# EAGLE design FSI6CAN (EAGLE 9.5.0)
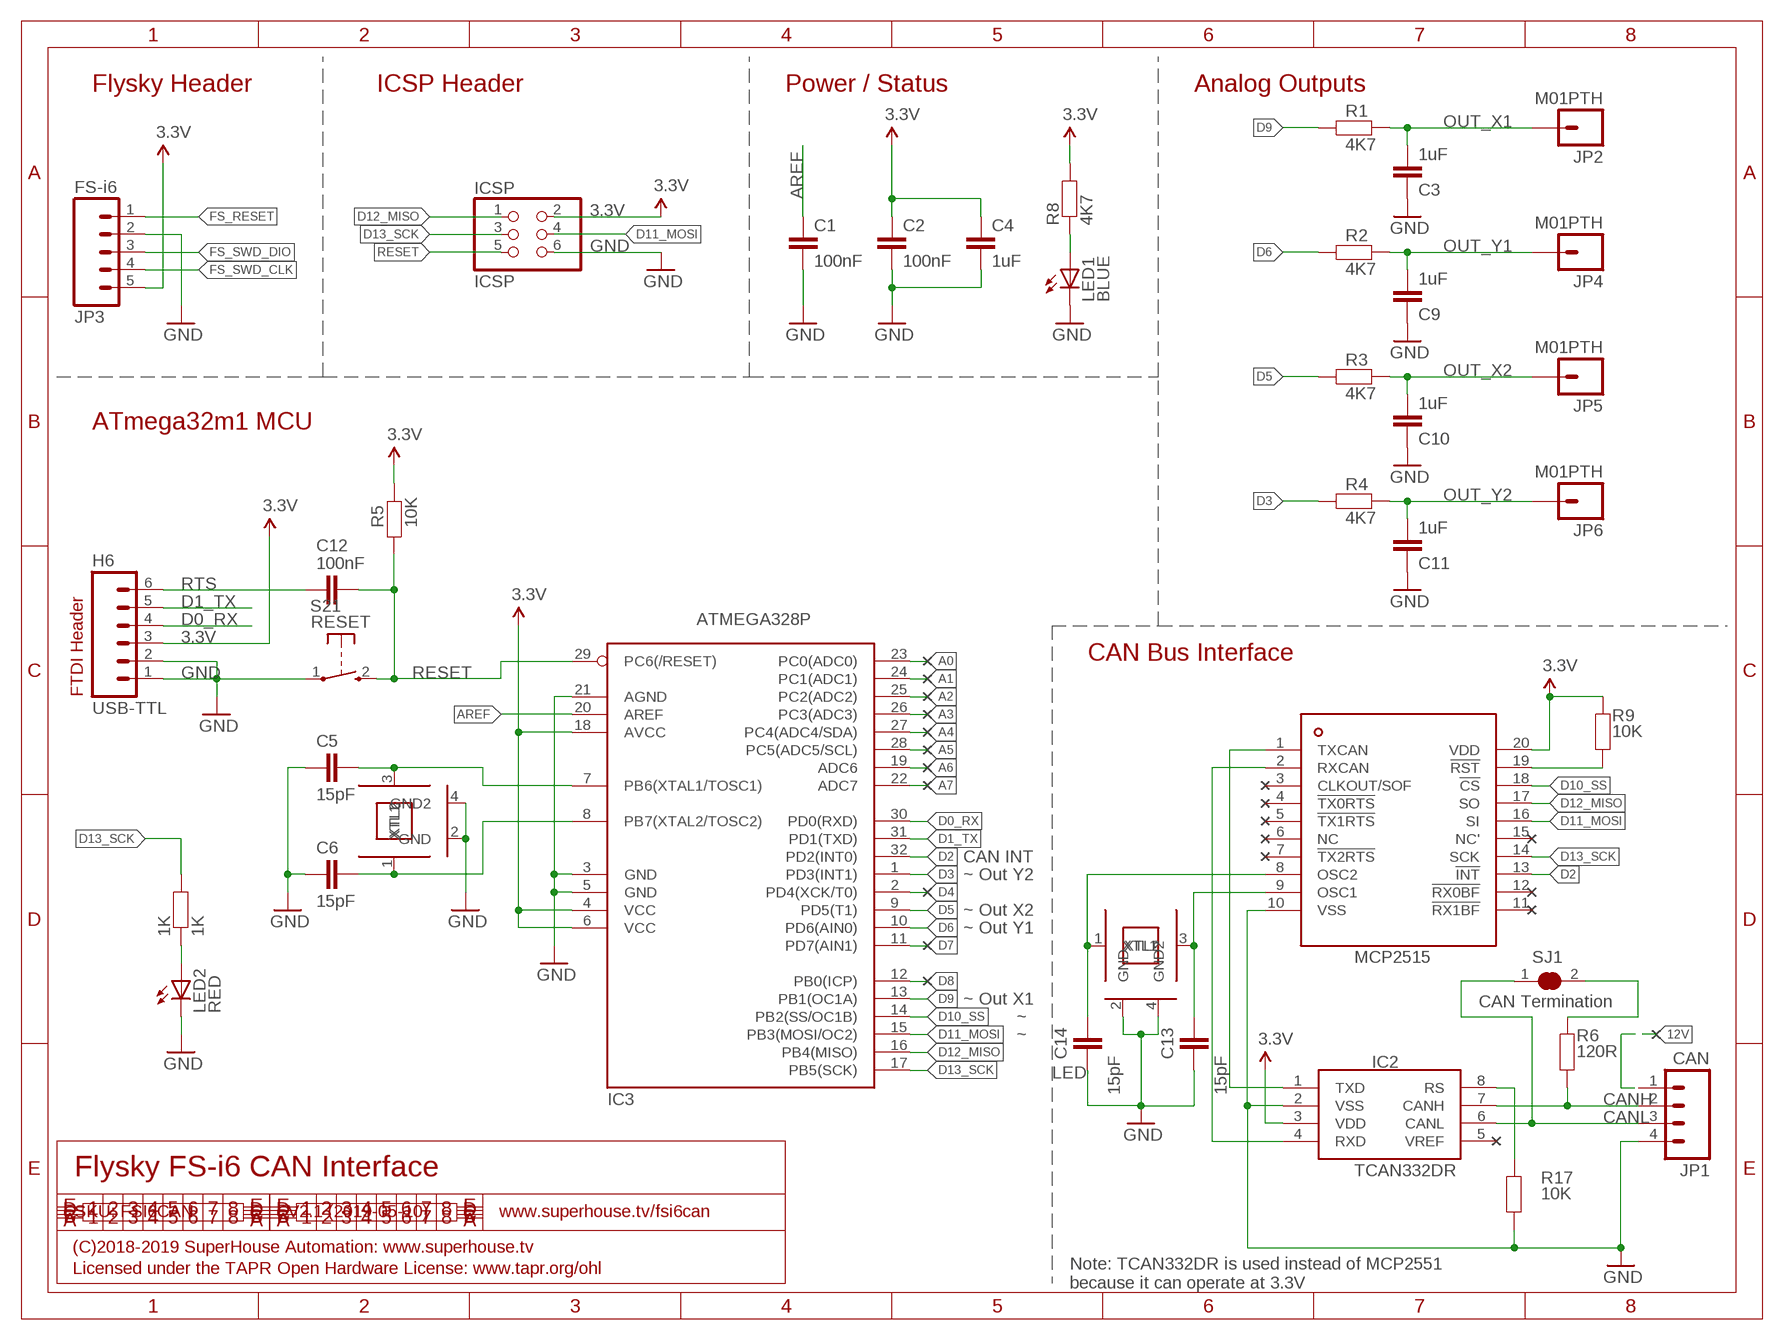
[diagram p0: schematic, sheet 1]

## Parts
1K  1K  RESISTOR0603  [R0603]
C1  100nF  CAP0603  [C0603]
C2  100nF  CAP0603  [0603]
C3  1uF  CAP0603  [C0603]
C4  1uF  CAP0603  [0603]
C5  15pF  CAP0603  [C0603]
C6  15pF  CAP0603  [C0603]
C9  1uF  CAP0603  [C0603]
C10  1uF  CAP0603  [C0603]
C11  1uF  CAP0603  [C0603]
C12  100nF  CAP0603  [0603]
C13  15pF  CAP0603  [C0603]
C14  15pF  CAP0603  [C0603]
H6  USB-TTL  M06SIP  [1X06]
IC2  TCAN332DR  MCP2551  [SO08]
IC3  ATMEGA328P  AVR-MEGA8-AI  [TQFP32-08]
IC4  MCP2515  [TSSOP20]
ICSP  ICSP  PINHD-2X3  [2X03]
JP1  CAN  M04PTH  [1X04]
JP2  M01PTH  [1X01]
JP3  FS-i6  M05PTH  [1X05]
JP4  M01PTH  [1X01]
JP5  M01PTH  [1X01]
JP6  M01PTH  [1X01]
LED1  BLUE  LED0603  [LED-0603]
LED2  RED  LED0603  [LED-0603]
R1  4K7  RESISTOR0603  [R0603]
R2  4K7  RESISTOR0603  [R0603]
R3  4K7  RESISTOR0603  [R0603]
R4  4K7  RESISTOR0603  [R0603]
R5  10K  RESISTOR0603  [0603]
R6  120R  RESISTOR0603  [0603]
R8  4K7  RESISTOR0603  [0603]
R9  10K  RESISTOR0603  [R0603]
R17  10K  RESISTOR0603  [R0603]
S21  RESET  TAC_SWITCH_2PINSMT  [TACTILE_SMT_3X4X2]
SJ1  CAN Termination  SJCN  [SJC]
XTL1  8MHz  CRYSTAL-GND3X2  [CRYSTAL-SMD-3X2]
XTL3  16MHz  CRYSTAL-GND3X2  [CRYSTAL-SMD-3X2]

## Nets
3.3V: C2.1 C4.1 H6.3 IC2.3(VDD) IC3.4(VCC) IC3.6(VCC) IC3.18(AVCC) IC4.20(VDD) ICSP.2 JP3.5 R5.1 R8.2 R9.2
12V: JP1.1
A0: IC3.23(PC0(ADC0))
A1: IC3.24(PC1(ADC1))
A2: IC3.25(PC2(ADC2))
A3: IC3.26(PC3(ADC3))
A4: IC3.27(PC4(ADC4/SDA))
A5: IC3.28(PC5(ADC5/SCL))
A6: IC3.19(ADC6)
A7: IC3.22(ADC7)
AREF: C1.1 IC3.20(AREF)
CANH: IC2.7(CANH) JP1.2 R6.1
CANL: IC2.6(CANL) JP1.3 SJ1.1
D0_RX: H6.4 IC3.30(PD0(RXD))
D1_TX: H6.5 IC3.31(PD1(TXD))
D2: IC3.32(PD2(INT0)) IC4.13(!INT)
D3: IC3.1(PD3(INT1)) R4.1
D4: IC3.2(PD4(XCK/T0))
D5: IC3.9(PD5(T1)) R3.1
D6: IC3.10(PD6(AIN0)) R2.1
D7: IC3.11(PD7(AIN1))
D8: IC3.12(PB0(ICP))
D9: IC3.13(PB1(OC1A)) R1.1
D10_SS: IC3.14(PB2(SS/OC1B)) IC4.18(!CS)
D11_MOSI: IC3.15(PB3(MOSI/OC2)) IC4.16(SI) ICSP.4
D12_MISO: IC3.16(PB4(MISO)) IC4.17(SO) ICSP.1
D13_SCK: 1K.2 IC3.17(PB5(SCK)) IC4.14(SCK) ICSP.3
FS_RESET: JP3.1
FS_SWD_CLK: JP3.4
FS_SWD_DIO: JP3.3
GND: C1.2 C2.2 C3.2 C4.2 C5.1 C6.1 C9.2 C10.2 C11.2 C13.1 C14.1 H6.1 H6.2 IC2.2(VSS) IC3.3(GND) IC3.5(GND) IC3.21(AGND) IC4.10(VSS) ICSP.6 JP1.4 JP3.2 LED1.C LED2.C R17.1 S21.1(P) XTL1.2(GND) XTL1.4(GND2) XTL3.2(GND) XTL3.4(GND2)
N$1: 1K.1 LED2.A
N$2: R6.2 SJ1.2
N$4: IC2.1(TXD) IC4.1(TXCAN)
N$5: LED1.A R8.1
N$6: IC2.4(RXD) IC4.2(RXCAN)
N$7: C13.2 IC4.9(OSC1) XTL3.3(XTL2)
N$8: C14.2 IC4.8(OSC2) XTL3.1(XTL1)
N$11: C5.2 IC3.7(PB6(XTAL1/TOSC1)) XTL1.3(XTL2)
N$12: C6.2 IC3.8(PB7(XTAL2/TOSC2)) XTL1.1(XTL1)
N$16: IC2.8(RS) R17.2
N$17: IC4.19(!RST) R9.1
OUT_X1: C3.1 JP2.1 R1.2
OUT_X2: C10.1 JP5.1 R3.2
OUT_Y1: C9.1 JP4.1 R2.2
OUT_Y2: C11.1 JP6.1 R4.2
RESET: C12.2 IC3.29(PC6(/RESET)) ICSP.5 R5.2 S21.2(S)
RTS: C12.1 H6.6
Unconnected: IC2.5(VREF) IC4.3(CLKOUT/SOF) IC4.4(!TX0RTS) IC4.5(!TX1RTS) IC4.6(NC) IC4.7(!TX2RTS) IC4.11(!RX1BF) IC4.12(!RX0BF) IC4.15(NC')

## Notes on the sheet
- Flysky Header | ICSP Header | Power / Status | Analog Outputs
- ATmega32m1 MCU
- CAN Bus Interface
- FTDI Header
- CAN INT
- ~ Out Y2
- ~ Out X2
- ~ Out Y1
- ~ Out X1
- ~
- ~
- LED
- Flysky FS-i6 CAN Interface
- SKU: FSI6CAN | V2.1 (2019-05-10) | www.superhouse.tv/fsi6can
- (C)2018-2019 SuperHouse Automation: www.superhouse.tv
- Licensed under the TAPR Open Hardware License: www.tapr.org/ohl
- Note: TCAN332DR is used instead of MCP2551
  because it can operate at 3.3V

## Library data of the parts
1K R1-R4 R9 R17 = SuperHouse-DiscreteSemi:RESISTOR: Resistor
C1 C3 C5 C6 C9-C11 C13 C14 = SuperHouse-DiscreteSemi:CAP: Capacitor
C2 C4 C12 = freetronics-master-v1.1:CAP: Capacitor
H6 = freetronics:M06: Header 6 Standard 6-pin 0.1" header. Use with straight break away headers (SKU : PRT-00116), right angle break away headers (PRT-00553), swiss pins (PRT-00743), machine pins (PRT-00117), and female headers (PRT-00115). Molex polarized connector foot print use with SKU : PRT-08094 with associated crimp pins and housings. NOTES ON THE VARIANTS LOCK and LOCK_LONGPADS... This footprint was designed to help hold the alignment of a through-hole component (i.e. 6-pin header) while soldering it into place. You may notice that each hole has been shifted either up or down by 0.005 of an inch from it's more standard position (which is a perfectly straight line). This slight alteration caused the pins (the squares in the middle) to touch the edges of the holes. Because they are alternating, it causes a "brace" to hold the component in place. 0.005 has proven to be the perfect amount of "off-center" position when using our standard breakaway headers. Although looks a little odd when you look at the bare footprint, once you have a header in there, the alteration is very hard to notice. Also, if you push a header all the way into place, it is covered up entirely on the bottom side. This idea of altering the position of holes to aid alignment will be further integrated into the Sparkfun Library for other footprints. It can help hold any component with 3 or more connection pins.
IC2 = freetronics-original:MCP2551
IC3 = freetronics-master-v1.1:AVR-MEGA8: MICROCONTROLLER 8 Kbytes FLASH 1 kbytes SRAM 512 bytes EEPROM USART 6-channel 10 bit ADC 2-channel 8 bit ADC
IC4 = MCP2515:MCP2515: Microchip Technology’s MCP2515 is a stand-alone Controller Area Network (CAN) controller that implements the CAN specification, version 2.0B. It is capable of transmitting and receiving both standard and extended data and remote frames. The MCP2515 has two acceptance masks and six acceptance filters that are used to filter out unwanted messages, thereby reducing the host MCUs overhead. The MCP2515 interfaces with microcontrollers (MCUs) via an industry standard Serial Peripheral Interface (SPI).
ICSP = pinhead:PINHD-2X3: PIN HEADER
JP1 = freetronics-jon:M04: Header 4 Standard 4-pin 0.1" header. Use with straight break away headers (SKU : PRT-00116), right angle break away headers (PRT-00553), swiss pins (PRT-00743), machine pins (PRT-00117), and female headers (PRT-00115). Molex polarized connector foot print use with SKU : PRT-08231 with associated crimp pins and housings. 1MM SMD Version SKU: PRT-10208
JP2 JP4-JP6 = freetronics-jon:M01: Header 1 Standard 1-pin 0.1" header. Use with straight break away headers (SKU : PRT-00116), right angle break away headers (PRT-00553), swiss pins (PRT-00743), machine pins (PRT-00117), and female headers (PRT-00115).
JP3 = freetronics-jon:M05: Header 5 Standard 5-pin 0.1" header. Use with straight break away headers (SKU : PRT-00116), right angle break away headers (PRT-00553), swiss pins (PRT-00743), machine pins (PRT-00117), and female headers (PRT-00115). Molex polarized connector foot print use with SKU : PRT-08230 with associated crimp pins and housings.
LED1 LED2 = freetronics-jon:LED: LEDs Standard schematic elements and footprints for 5mm, 3mm, 1206, and 0603 sized LEDs. 5mm - Spark Fun Electronics SKU : COM-00529 (and others)
R5 R6 = freetronics-master-v1.1:RESISTOR: Resistor
R8 = freetronics-jon:RESISTOR: Resistor
S21 = SuperHouse-Switches:TAC_SWITCH_2PIN: Momentary Tactile Switch - 2 pin Uxcell 3x4x2mm switch with 2 SMT pads
SJ1 = freetronics-jon:SJC
XTL1 XTL3 = freetronics-jon:CRYSTAL-GND

## Board
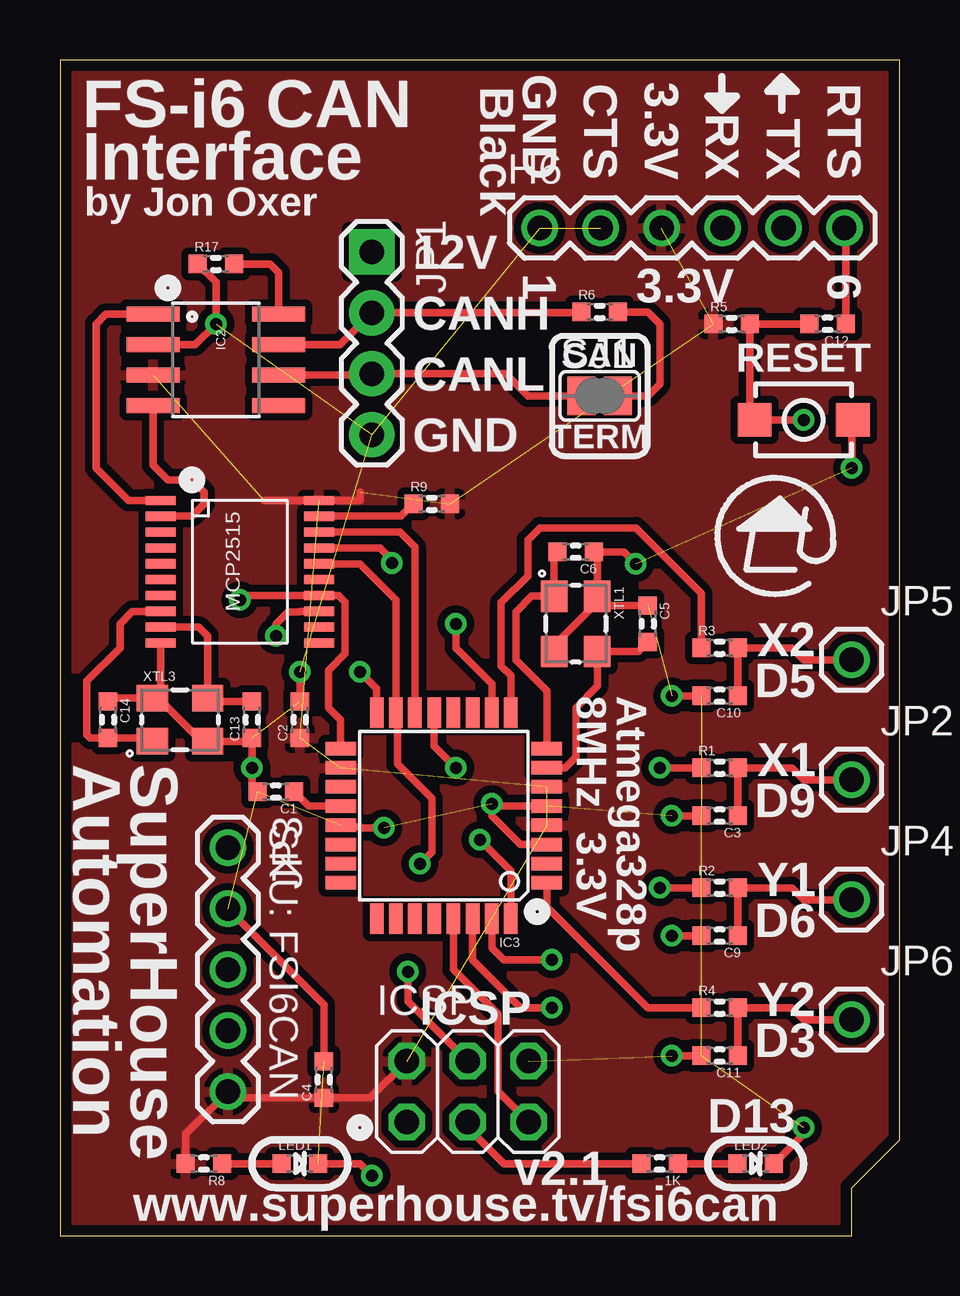
[diagram p1: board, top side]
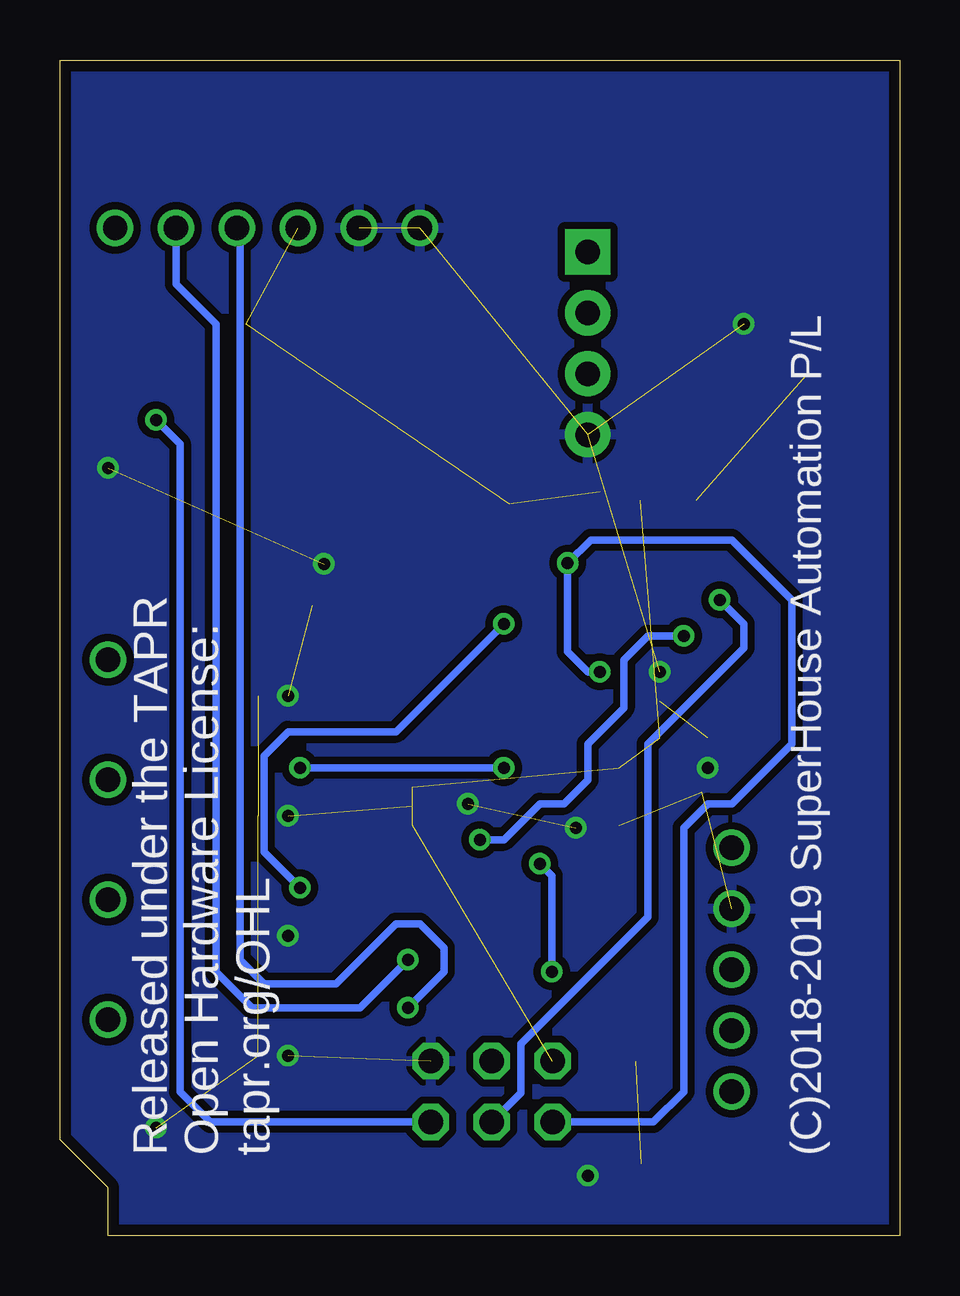
[diagram p2: board, bottom side, seen from below]

Size 35 x 49 mm. Coordinates in mm from the lower left corner, seen from the top.
Outline: 35,4 35,49 0,49 0,0 33,0 33,2 35,4
Copper layers (1*16): Top 0.035mm / dielectric 1.5mm / Bottom 0.035mm
Design rules "default *": minimum track width 10mil, minimum drill 0.5mm, track to track 12mil, track to pad 12mil, pad to pad 12mil, via to via 12mil, smd to smd 8mil, copper to edge 18mil, drill to drill 8mil, minimum pad ring 10mil, minimum via ring 8mil, stop-mask expansion 0.4mm, vias tented up to drill 0.7mm, thermal gap 10mil

### Footprints (pad centres in the part's own frame; a part is rotated, then mirrored left to right if it is on the bottom)
R0603 = smd 0.762 x 0.762: 1 -0.762,0; 2 0.762,0
C0603 = smd 0.762 x 0.762: 1 -0.762,0; 2 0.762,0
0603 = smd 0.762 x 0.762: 1 -0.762,0; 2 0.762,0
1X06 = drill 1.016: 1 0,0; 2 2.54,0; 3 5.08,0; 4 7.62,0; 5 10.16,0; 6 12.7,0
SO08 = smd 0.61 x 2.21: 1 -1.905,-2.616; 2 -0.635,-2.616; 3 0.635,-2.616; 4 1.905,-2.616; 5 1.905,2.616; 6 0.635,2.616; 7 -0.635,2.616; 8 -1.905,2.616
TQFP32-08 = smd 1.27 x 0.559: 1 -4.293,2.8; 2 -4.293,2; 3 -4.293,1.2; 4 -4.293,0.4; 5 -4.293,-0.4; 6 -4.293,-1.2; 7 -4.293,-2; 8 -4.293,-2.8; 17 4.293,-2.8; 18 4.293,-2; 19 4.293,-1.2; 20 4.293,-0.4; 21 4.293,0.4; 22 4.293,1.2; 23 4.293,2; 24 4.293,2.8 | smd 0.559 x 1.27: 9 -2.8,-4.293; 10 -2,-4.293; 11 -1.2,-4.293; 12 -0.4,-4.293; 13 0.4,-4.293; 14 1.2,-4.293; 15 2,-4.293; 16 2.8,-4.293; 25 2.8,4.293; 26 2,4.293; 27 1.2,4.293; 28 0.4,4.293; 29 -0.4,4.293; 30 -1.2,4.293; 31 -2,4.293; 32 -2.8,4.293
TSSOP20 = smd 1.27 x 0.381: 1 -3.302,2.642; 2 -3.302,1.981; 3 -3.302,1.321; 4 -3.302,0.66; 5 -3.302,0; 6 -3.302,-0.66; 7 -3.302,-1.321; 8 -3.302,-1.981; 9 -3.302,-2.642; 10 -3.302,-3.302; 11 3.302,-3.302; 12 3.302,-2.642; 13 3.302,-1.981; 14 3.302,-1.321; 15 3.302,-0.66; 16 3.302,0; 17 3.302,0.66; 18 3.302,1.321; 19 3.302,1.981; 20 3.302,2.642
2X03 = drill 1.016 octagon: 1 -2.54,-1.27; 2 -2.54,1.27; 3 0,-1.27; 4 0,1.27; 5 2.54,-1.27; 6 2.54,1.27
1X04 = drill 1.016 pad 1.88 square: 1 0,0 | drill 1.016 pad 1.88: 2 2.54,0; 3 5.08,0; 4 7.62,0
1X01 = drill 1.016: 1 0,0
1X05 = drill 1.016: 1 0,0; 2 2.54,0; 3 5.08,0; 4 7.62,0; 5 10.16,0
LED-0603 = smd 0.762 x 0.762: A -0.762,0; C 0.762,0
TACTILE_SMT_3X4X2 = smd 1.4 x 1.4: 1 -2.05,0; 2 2.05,0
SJC = smd 1.168 x 1.6: 1 -0.762,0; 2 0.762,0
CRYSTAL-SMD-3X2 = smd 1.3 x 1.1: 1 -1.15,-0.9; 2 1.15,-0.9; 3 1.15,0.9; 4 -1.15,0.9

### Placement (x,y rotation side)
1K  25,3 180 top
C1  9,18.5 180 top
C2  10,21.5 90 top
C3  27.5,17.5 180 top
C4  11,6.5 90 top
C5  24.5,25.5 270 top
C6  21.5,28.5 180 top
C9  27.5,12.5 180 top
C10  27.5,22.5 180 top
C11  27.5,7.5 180 top
C12  32,38 180 top
C13  8,21.5 90 top
C14  2,21.5 270 top
H6  20,42 0 top
IC2  6.5,36.5 270 top
IC3  16,17.5 180 top
IC4  7.5,28 0 top
ICSP  17,6 0 top
JP1  13,41 270 top
JP2  33,19 0 top
JP3  7,16.16 270 top
JP4  33,14 0 top
JP5  33,24 0 top
JP6  33,9 0 top
LED1  10,3 0 top
LED2  29,3 0 top
R1  27.5,19.5 0 top
R2  27.5,14.5 0 top
R3  27.5,24.5 0 top
R4  27.5,9.5 0 top
R5  28,38 0 top
R6  22.5,38.5 0 top
R8  6,3 180 top
R9  15.5,30.5 0 top
R17  6.5,40.5 0 top
S21  31,34 180 top
SJ1  22.5,35 0 top
XTL1  21.5,25.5 270 top
XTL3  5,21.5 0 top

### Tracks (layer width: path | path; a pad name or v marks a point on that pad's centre or on a via)
3.3V  (9 unrouted)
  Top 0.305: R8.2 5.24,4.24 JP3.5 7.26,5.74 C4.1 12.93,5.74 ICSP.2 | 12.5,31 12.5,30.64 IC4.20 8.5,30.64
  pour Top: 35,4 33,2 33,0 0,0 0,49 35,49
AREF
  Top 0.305: C1.1 10.36,17.9 IC3.20
CANH
  Top 0.305: IC2.7 11.68,37.13 JP1.2 21.7,38.46 R6.1
CANL
  Top 0.305: IC2.6 12.95,35.87 JP1.3 18.58,35.92 19.5,35 SJ1.1
D0_RX  (via drill 0.5)
  Top 0.305: IC3.30 17.2,11.5 19.2,9.5 v20.5,9.5
  Bottom 0.305: v20.5,9.5 19,11 19,12 20,13 21,13 23.5,10.5 26.5,10.5 27.5,11.5 27.5,41.88 H6.4
D1_TX  (via drill 0.5)
  Top 0.305: IC3.31 18,12 18.5,11.5 v20.5,11.5
  Bottom 0.305: v20.5,11.5 22.5,9.5 27,9.5 28.5,11 28.5,38 30.16,39.66 H6.5
D2  (via drill 0.5)
  Top 0.305: IC4.13 10.79,26.01 9.98,26.01 9.97,26 9.5,26 9,25.5 v9,25 | v17.5,16.5 18.8,15.2 IC3.32
  Bottom 0.305: v9,25 10.5,25 11.5,24 11.5,22 13,20.5 13,19 14,18 15,18 16.5,16.5 v17.5,16.5
D3
  Top 0.305: R4.1 24.5,9.5 20.29,13.71 IC3.1
D5
  Top 0.305: IC3.9 18.8,23.34 18.39,23.75 18.39,26.39 19.5,27.5 19.5,29 20,29.5 24,29.5 26.74,26.76 R3.1
D6  (via drill 0.5)
  Top 0.305: R2.1 v25,14.5 | v16.5,25.5 16.5,24.5 18,23 IC3.10
  Bottom 0.305: v25,14.5 26.5,16 26.5,20 25.5,21 21,21 v16.5,25.5
D9  (via drill 0.5)
  Top 0.305: R1.1 v25,19.5 | IC3.13 15.6,20.4 v16.5,19.5
  Bottom 0.305: v16.5,19.5 v25,19.5
D10_SS
  Top 0.305: IC4.18 14.18,29.32 14.8,28.7 IC3.14
D11_MOSI  (via drill 0.5)
  Top 0.305: IC4.16 12.5,28 14,26.5 IC3.15 14.06,21.73 14.06,19.65 15.5,18.21 15.5,16 v15,15.5 | ICSP.4 14.5,9.77 v14.5,11
  Bottom 0.305: v14.5,11 14.5,15 v15,15.5
D12_MISO  (via drill 0.5)
  Top 0.305: IC4.17 13.34,28.66 14,28 13.87,28 v13.84,28.03 | v12.5,23.5 13.2,22.8 IC3.16
  Bottom 0.305: v12.5,23.5 13,23.5 13.84,24.34 v13.84,28.03 12.87,29 7,29 4.5,26.5 4.5,20.5 7,18 8,18 9,17 9,6 10.27,4.73 ICSP.1
D13_SCK  (via drill 0.5)
  Top 0.305: ICSP.3 17,4.5 18.5,3 1K.2 | IC3.17 11.71,21.5 11.21,22 11.19,22 11.19,23.56 11.89,24.26 11.89,26.4 11.61,26.68 IC4.14 7.68,26.68 v7.5,26.5
  Bottom 0.305: ICSP.3 15.78,5.95 15.78,8 10.5,13.28 10.5,20.5 6.5,24.5 6.5,25.5 v7.5,26.5
GND  (via drill 0.5)  (17 unrouted)
  Top 0.305: v31,4.5 31,4.24 LED2.C | C10.2 v25.5,22.5 | C3.2 v25.5,17.5 | C9.2 v25.5,12.5 | C11.2 v25.5,7.5 | LED1.C 12.5,3 v13,2.5 | C4.2 11,9.62 JP3.2 | IC3.21 11.77,17.04 12.53,17.04 12.57,17 v13.5,17 | IC3.3 19.2,16.3 18,17.5 v18,18 18.1,17.9 IC3.5 | C1.2 8,18.74 v8,19.5 C13.1 7.86,20.6 XTL3.2 5.9,20.6 4.1,22.4 XTL3.4 | IC2.2 5.63,37.13 v6.5,38 6.5,39.74 R17.1 | XTL1.4 22.4,28.36 C6.1 23.5,28.5 v24,28 | C5.1 22.79,26.26 XTL1.4 | XTL1.2 20.6,24.6 22.4,26.4 XTL1.4 | C14.1 2.14,22.4 XTL3.4 | IC4.10 4.2,22.75 XTL3.4 | v10,23.5 C2.2 | S21.1 33,33.95 v33,32
  pour Bottom: 35,4 33,2 33,0 0,0 0,49 35,49
N$1
  Top 0.305: LED2.A 1K.1
N$2
  Top 0.305: SJ1.2 24.5,35 25,35.5 25,38 24.5,38.5 R6.2
N$4
  Top 0.305: IC4.1 2.86,30.64 1.5,32 1.5,38 1.91,38.41 IC2.1
N$5
  Top 0.305: R8.1 LED1.A
N$6
  Top 0.305: IC4.2 4.21,29.99 5.02,29.99 5.03,30 5.5,30 6,30.5 6,31 5.5,31.5 4.5,31.5 3.88,32.12 IC2.4
N$7
  Top 0.305: C13.2 6.29,22.26 XTL3.3 6.15,25 5.79,25.36 IC4.9
N$8
  Top 0.305: XTL3.1 3.71,20.74 C14.2 1.26,20.74 1.11,20.89 1.11,23.11 2.5,24.5 2.5,25.5 3.02,26.02 IC4.8
N$11
  Top 0.305: C5.2 24.11,24.35 XTL1.3 22.4,22.9 21.5,22 21.5,19.95 21.05,19.5 IC3.7
N$12
  Top 0.305: C6.2 20.6,28.36 XTL1.1 19.65,26.65 19,26 19,24 20.29,22.71 IC3.8
N$16
  Top 0.305: R17.2 8.76,40.5 9.12,40.15 IC2.8
N$17
  Top 0.305: IC4.19 14.22,29.98 R9.1
OUT_X1
  Top 0.305: C3.1 R1.2 30.5,19.5 31,19 JP2.1
OUT_X2
  Top 0.305: C10.1 R3.2 30.5,24.5 31,24 JP5.1
OUT_Y1
  Top 0.305: C9.1 R2.2 30.5,14.5 31,14 JP4.1
OUT_Y2
  Top 0.305: C11.1 R4.2 30.5,9.5 31,9 JP6.1
RESET  (via drill 0.5)
  Top 0.305: C12.2 R5.2 28.76,34.19 S21.2 v31,34 | IC3.29 16.4,11.1 18.25,9.25 18.25,6.02 ICSP.5
  Bottom 0.305: v31,34 30,33 30,6 28.73,4.73 ICSP.5
RTS
  Top 0.305: H6.6 32.76,41.94 C12.1

### Text on the board
tPlace: FS-i6 CAN / Interface | GND | CTS | 3.3V | RX | TX | RTS | by Jon Oxer | Black | 12V | 3.3V | 1 | 6 | CANH | CANL | CAN | RESET | GND | TERM | X2 / D5 | Atmega328p / 8MHz 3.3V | SuperHouse / Automation | X1 / D9 | SKU: FSI6CAN | Y1 / D6 | ICSP | Y2 / D3 | D13 | v2.1 | www.superhouse.tv/fsi6can
bPlace: (C)2018-2019 SuperHouse Automation P/L | Released under the TAPR / Open Hardware License: / tapr.org/OHL